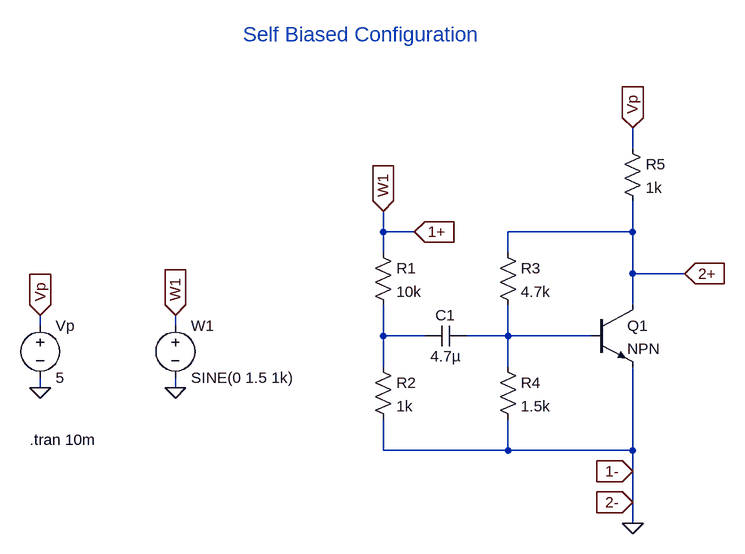
[diagram p0: schematic self_biased_config.asc]
self_biased_config.asc, the LTspice schematic file:
Version 4
SHEET 1 1228 712
WIRE 768 96 768 64
WIRE 384 224 384 192
WIRE 432 224 384 224
WIRE 768 224 768 176
WIRE 768 224 576 224
WIRE 384 256 384 224
WIRE 576 256 576 224
WIRE 768 288 768 224
WIRE 848 288 768 288
WIRE 768 336 768 288
WIRE -144 368 -144 352
WIRE 64 368 64 352
WIRE 384 384 384 336
WIRE 448 384 384 384
WIRE 576 384 576 336
WIRE 576 384 512 384
WIRE 704 384 576 384
WIRE 384 432 384 384
WIRE 576 432 576 384
WIRE -144 464 -144 448
WIRE 64 464 64 448
WIRE 384 560 384 512
WIRE 576 560 576 512
WIRE 576 560 384 560
WIRE 768 560 768 432
WIRE 768 560 576 560
WIRE 768 592 768 560
WIRE 768 640 768 592
WIRE 768 672 768 640
FLAG 768 672 0
FLAG 384 192 W1
IOPIN 384 192 In
FLAG 768 64 Vp
IOPIN 768 64 In
FLAG 432 224 1+
IOPIN 432 224 In
FLAG 848 288 2+
IOPIN 848 288 In
FLAG 768 640 2-
IOPIN 768 640 In
FLAG 64 464 0
FLAG -144 464 0
FLAG 64 352 W1
IOPIN 64 352 In
FLAG -144 352 Vp
IOPIN -144 352 In
FLAG 768 592 1-
IOPIN 768 592 In
SYMBOL res 368 240 R0
SYMATTR InstName R1
SYMATTR Value 10k
SYMBOL res 368 416 R0
SYMATTR InstName R2
SYMATTR Value 1k
SYMBOL res 560 240 R0
SYMATTR InstName R3
SYMATTR Value 4.7k
SYMBOL res 560 416 R0
SYMATTR InstName R4
SYMATTR Value 1.5k
SYMBOL res 752 80 R0
SYMATTR InstName R5
SYMATTR Value 1k
SYMBOL npn 704 336 R0
SYMATTR InstName Q1
SYMBOL cap 512 368 R90
WINDOW 0 0 32 VBottom 2
WINDOW 3 32 32 VTop 2
SYMATTR InstName C1
SYMATTR Value 4.7µ
SYMBOL voltage 64 352 R0
WINDOW 123 0 0 Left 0
WINDOW 39 0 0 Left 0
SYMATTR InstName W1
SYMATTR Value SINE(0 1.5 1k)
SYMBOL voltage -144 352 R0
WINDOW 123 0 0 Left 0
WINDOW 39 0 0 Left 0
SYMATTR InstName Vp
SYMATTR Value 5
TEXT 168 -80 Left 3 ;Self Biased Configuration
TEXT -160 544 Left 2 !.tran 10m

The netlist it stands for:
* self_biased_config.asc
R1 1+ N001 10k
R2 N001 0 1k
R3 2+ N002 4.7k
R4 N002 0 1.5k
R5 Vp 2+ 1k
Q1 2+ N002 0 0 NPN
C1 N002 N001 4.7µ
V§W1 1+ 0 SINE(0 1.5 1k)
Vp Vp 0 5
.model NPN NPN
.model PNP PNP
.lib standard.bjt
* Self Biased Configuration
.tran 10m
.backanno
.end